# Altium schematic sheet audio.SchDoc
size A; SheetNumber: 4; SheetTotal: 5
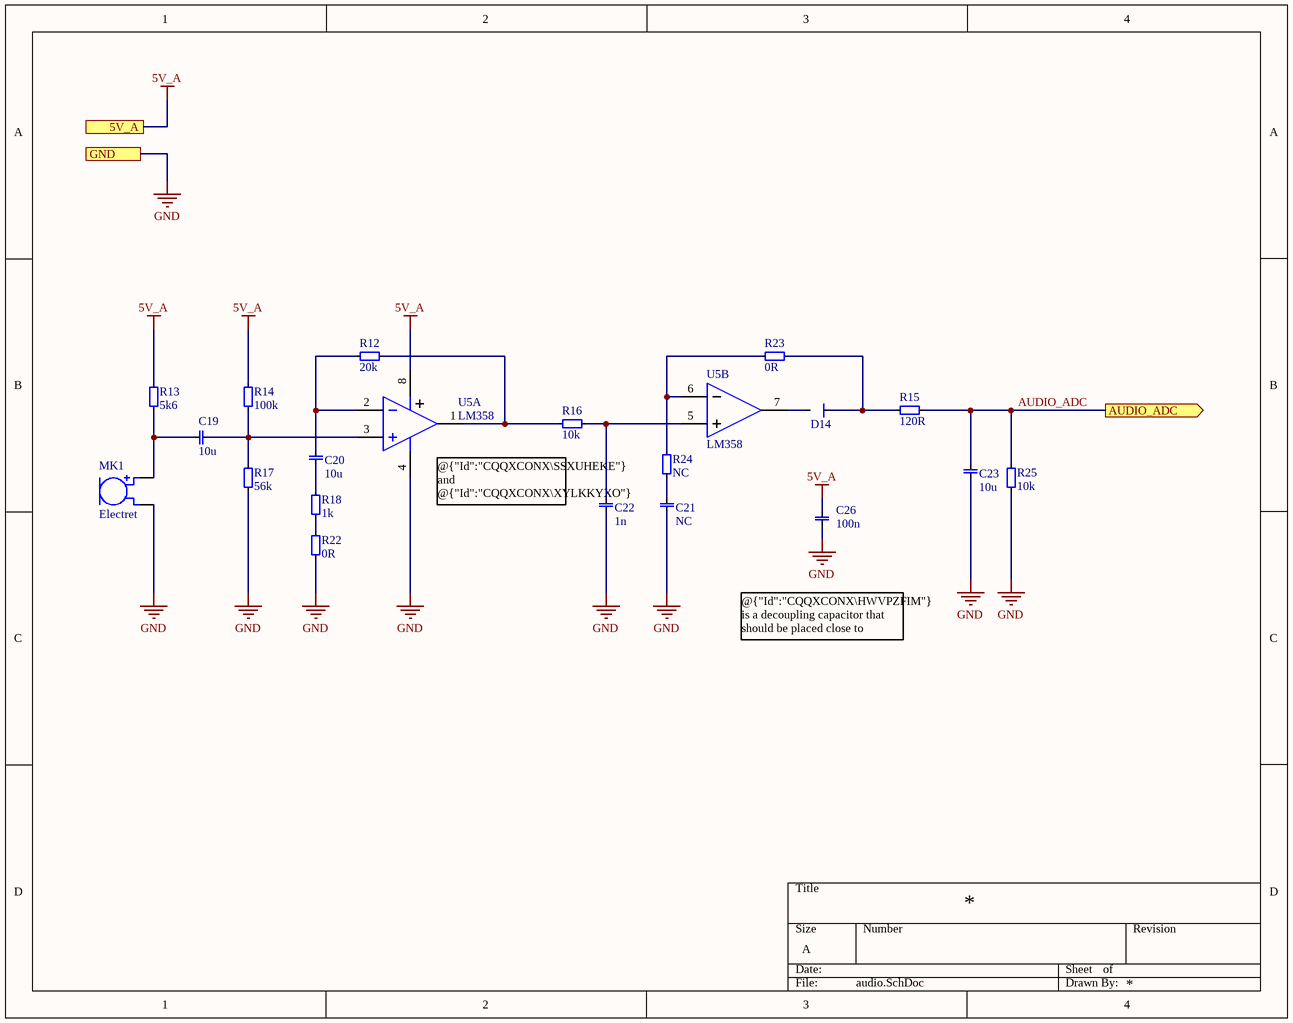
[diagram p0: audio.SchDoc]

## Parts
C19  value 10u  [0603 cap]  (hidden comment: 0603, capacitor)
C20  value 10u  [0603 cap]  (hidden comment: 0603, capacitor)
C21  value NC  [0603 cap]  (hidden comment: 0603, capacitor)
C22  value 1n  [0603 cap]  (hidden comment: 0603, capacitor)
C23  value 10u  [0603 cap]  (hidden comment: 0603, capacitor)
C26  value 100n  [0603 cap]  (hidden comment: 0603, capacitor)
D14  Diode, SMD  [SOD323]  (value not drawn)
MK1  Electret  [ElectretMic_9.7mm_6.7mm]
R12  value 20k  [0603]  (hidden comment: 0603, resistor)
R13  value 5k6  [0603]  (hidden comment: 0603, resistor)
R14  value 100k  [0603]  (hidden comment: 0603, resistor)
R15  value 120R  [0603]  (hidden comment: 0603, resistor)
R16  value 10k  [0603]  (hidden comment: 0603, resistor)
R17  value 56k  [0603]  (hidden comment: 0603, resistor)
R18  value 1k  [0603]  (hidden comment: 0603, resistor)
R22  value 0R  [0603]  (hidden comment: 0603, resistor)
R23  value 0R  [0603]  (hidden comment: 0603, resistor)
R24  value NC  [0603]  (hidden comment: 0603, resistor)
R25  value 10k  [0603]  (hidden comment: 0603, resistor)
U5  LM358  [SOIC8]  (parts A,B of 2)

## Ports
5V_A, AUDIO_ADC (out), GND

## Nets
5V_A: C26.1 R13.0 R14.0 U5.8(V+) ; port 5V_A
GND: C21.0 C22.0 C23.1 C26.0 MK1.2 R17.1 R22.0 R25.1 U5.4(V-) ; port GND
AUDIO_ADC: C23.0 R15.1 R25.0 ; port AUDIO_ADC
NetC19_0: C19.0 R14.1 R17.0 U5.3(IN+)
NetC19_1: C19.1 MK1.1 R13.1
NetC20_0: C20.0 R18.0
NetC20_1: C20.1 R12.0 U5.2(IN-)
NetC21_1: C21.1 R24.1
NetC22_1: C22.1 R16.1 U5.5(IN+)
NetD14_1: D14.1 R15.0 R23.1
NetD14_2: D14.2 U5.7(OUT2)
NetR12_1: R12.1 R16.0 U5.1(OUT1)
NetR18_1: R18.1 R22.1
NetR23_0: R23.0 R24.0 U5.6(IN-)

## Notes on the sheet
- (near U5) @{"Id":"CQQXCONX\SSXUHEKE"} and @{"Id":"CQQXCONX\XYLKKYXO"} should have a time constant of 110 ms (2.2 1/20 Hz)
- @{"Id":"CQQXCONX\HWVPZFIM"} is a decoupling capacitor that should be placed close to @{"Id":"CQQXCONX\QJIXHWMY"}/ @{"Id":"CQQXCONX\NZEVYOYY"}.

## Library data of the parts
C19 C20 C23 = 0603, capacitor: Manufacturer Part Number: TMK107BBJ106MA-T; JLCPCB Part #: C386081; Mount: Yes
C21 = 0603, capacitor: Mount: No
C22 C26 = 0603, capacitor: Manufacturer Part Number: CC0603KRX7R9BB102; Mount: Yes
  C22: JLCPCB Part #: C100040
  C26: JLCPCB Part #: C14663
D14 = Diode, SMD: Manufacturer Part Number: BAT760,115; JLCPCB Part #: C117941; Mount: Yes
MK1 = Electret Mic: D9.7mm H6.7mm, Electrokit art nr: 40290007; Mount: No
R12 = 0603, resistor: Manufacturer Part Number: RT0603BRD0720KL; JLCPCB Part #: C723637; Mount: Yes
R13 = 0603, resistor: Manufacturer Part Number: AC0603FR-075K6L; JLCPCB Part #: C138278; Mount: Yes
R14 = 0603, resistor: Manufacturer Part Number: RC0603FR-07100KL; JLCPCB Part #: C14675; Mount: Yes
R15 = 0603, resistor: Manufacturer Part Number: RC0603JR-07120RL; JLCPCB Part #: C114681; Mount: Yes
R16 R25 = 0603, resistor: Manufacturer Part Number: RC0603FR-0710KL; JLCPCB Part #: C98220; Mount: Yes
R17 = 0603, resistor: Manufacturer Part Number: C3216X7R1C106KT000N; JLCPCB Part #: C114630; Mount: Yes
R18 = 0603, resistor: Manufacturer Part Number: CR0603-FX-1001ELF; JLCPCB Part #: C21190; Mount: Yes
R22 R23 = 0603, resistor: Manufacturer Part Number: RC0603JR-070RL; JLCPCB Part #: C95177; Mount: Yes
R24 = 0603, resistor: Mount: No
U5 = LM358: Dual FET-Input Operational Amplifier; Value: 595-LM358P; Mount: No